# Altium schematic sheet Encoder.SchDoc
size A; SheetNumber: 2; SheetTotal: 5
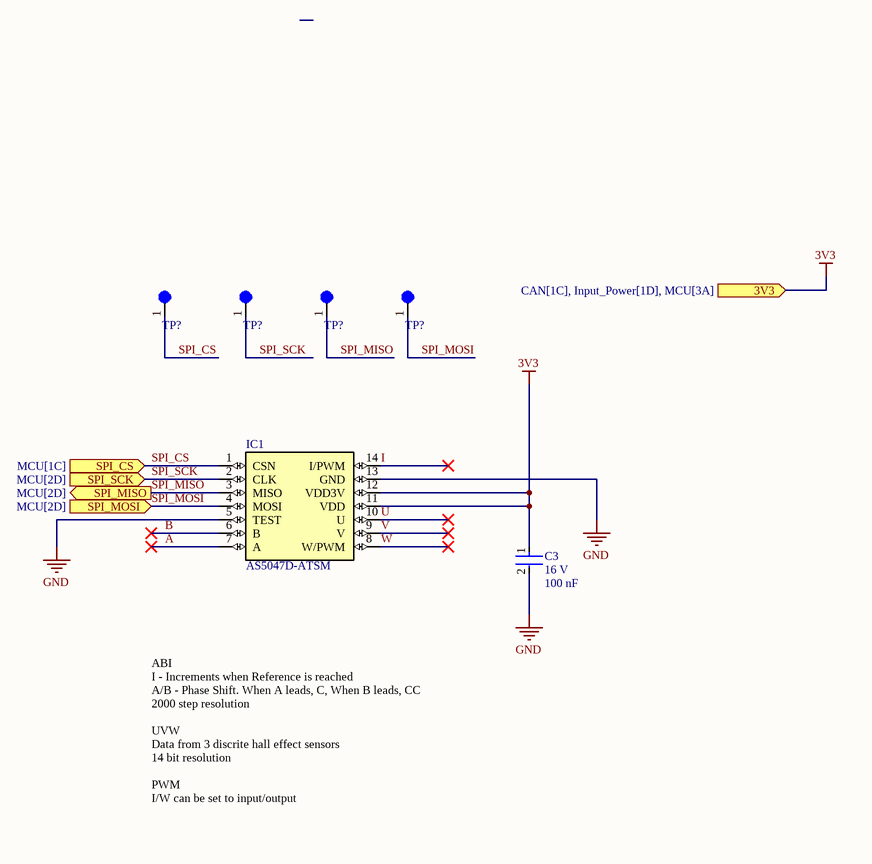
[diagram p0: Encoder.SchDoc]

## Parts
(Parts that share a designator on the sheet are numbered #1, #2 ... from top to bottom, then left to right.)
C3  Voltage Rating: 16 V  Capacitance: 100 nF  [CAP-0402]  (hidden comment: CC0402KRX7R7BB104)
IC1  AS5047D-ATSM  [SOP65P640X110-14N]
TP?#1  5003  [TEST02]  (value not drawn)
TP?#2  5003  [TEST02]  (value not drawn)
TP?#3  5003  [TEST02]  (value not drawn)
TP?#4  5003  [TEST02]  (value not drawn)

## Ports
3V3 (in, see CAN[1C], Input_Power[1D], MCU[3A]), SPI_CS (in, see MCU[1C]), SPI_MISO (out, see MCU[2D]), SPI_MOSI (in, see MCU[2D]), SPI_SCK (in, see MCU[2D])

## Nets
3V3: C3.1 IC1.11(VDD) IC1.12(VDD3V) ; port 3V3
GND: C3.2 IC1.5(TEST) IC1.13(GND)
A: IC1.7(A)
B: IC1.6(B)
I: IC1.14(I/PWM)
SPI_CS: IC1.1(CSN) TP?#1.1 ; port SPI_CS
SPI_MISO: IC1.3(MISO) TP?#3.1 ; port SPI_MISO
SPI_MOSI: IC1.4(MOSI) TP?#4.1 ; port SPI_MOSI
SPI_SCK: IC1.2(CLK) TP?#2.1 ; port SPI_SCK
U: IC1.10(U)
V: IC1.9(V)
W: IC1.8(W/PWM)

## Notes on the sheet
- ABI
  I - Increments when Reference is reached
  A/B - Phase Shift. When A leads, C, When B leads, CC
  2000 step resolution
  UVW
  Data from 3 discrite hall effect sensors
  14 bit resolution
  PWM
  I/W can be set to input/output

## Library data of the parts
C3 = CAP-0.1U-0001: CAP CER 0.1UF 16V X7R 0402; ComponentLink2Description: Datasheet; ComponentLink2URL: https://www.yageo.com/upload/media/product/productsearch/datasheet/mlcc/UPY-GPHC_X7R_6.3V-to-250V_24.pdf; Device Class: Ceramic; Size: 0402
IC1 = IC-ABSENC-0001: Hall Effect Sensor Rotary Position External Magnet, Not Included Gull Wing; MF: ams; SnapEDA_Link: https://www.snapeda.com/parts/AS5047D-ATSM/ams/view-part/?ref=snap; Package: TSSOP-14 ams; Value: *; MP: AS5047D-ATSM; Check_prices: https://www.snapeda.com/parts/AS5047D-ATSM/ams/view-part/?ref=eda; ComponentLink1Description: Datasheet; ComponentLink1URL: https://www.mouser.com/datasheet/3/5912/1/AS5047U_DS000637_1_01.pdf
TP?#1-TP?#4 = TEST-POINT-0002: Surface Mount